# Altium schematic sheet CONNECTOR_BUFFER.SchDoc
size A4; DrawnBy: Copyright © 2023 by; Engineer: Artyom Kislevitz Lee; Revision: A
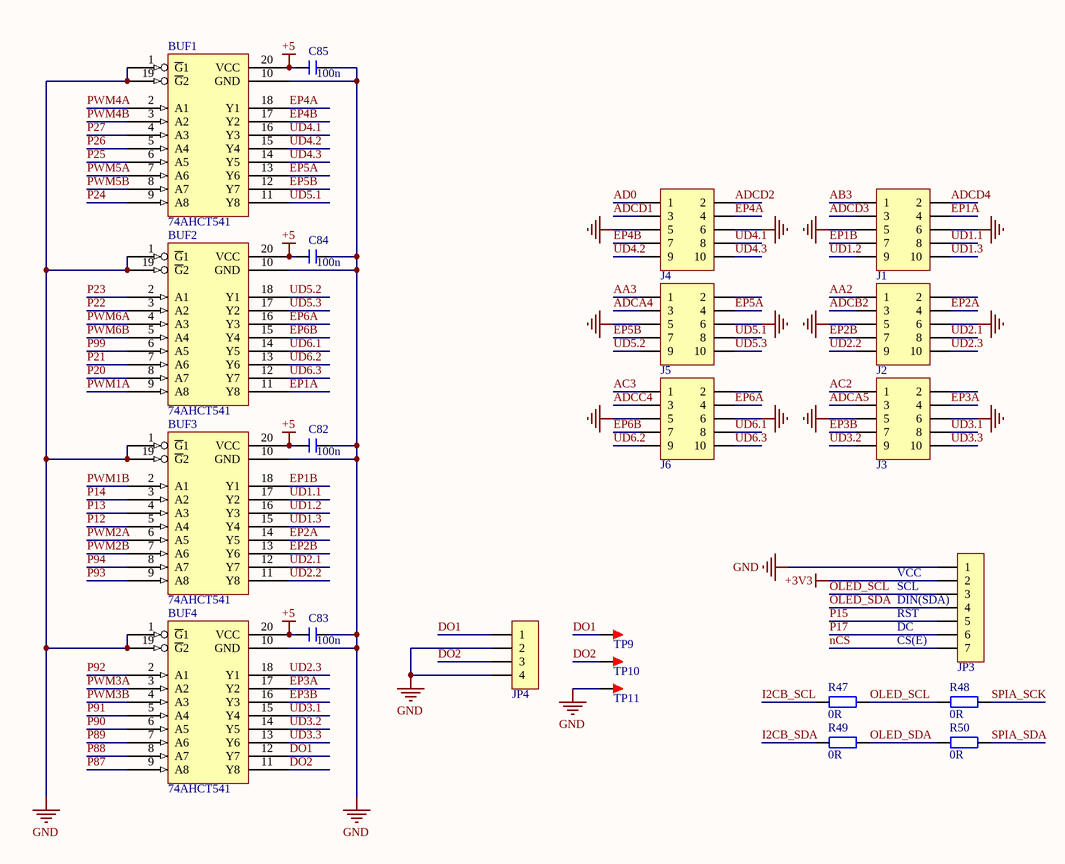
[diagram p0: CONNECTOR_BUFFER.SchDoc]

## Parts
BUF1  74AHCT541  [TSSOP20_N]
BUF2  74AHCT541  [TSSOP20_N]
BUF3  74AHCT541  [TSSOP20_N]
BUF4  74AHCT541  [TSSOP20_N]
C82  100n  [C 0805_L]
C83  100n  [C 0805_L]
C84  100n  [C 0805_L]
C85  100n  [C 0805_L]
J1  Header 5X2  [IDC2.54-LI-2x5P]  (value not drawn)
J2  Header 5X2  [IDC2.54-LI-2x5P]  (value not drawn)
J3  Header 5X2  [IDC2.54-LI-2x5P]  (value not drawn)
J4  Header 5X2  [IDC2.54-LI-2x5P]  (value not drawn)
J5  Header 5X2  [IDC2.54-LI-2x5P]  (value not drawn)
J6  Header 5X2  [IDC2.54-LI-2x5P]  (value not drawn)
JP3  HDR-1X7  [HDR2.54-M-LI-7P]  (value not drawn)
JP4  HDR-1X4  [HDR2.54-LI-4P]  (value not drawn)
R47  0R  [R 0805_L]
R48  0R  [R 0805_L]
R49  0R  [R 0805_L]
R50  0R  [R 0805_L]
TP9  TEST TP  [TEST TP1.4_B]  (value not drawn)
TP10  TEST TP  [TEST TP1.4_B]  (value not drawn)
TP11  TEST TP  [TEST TP1.4_B]  (value not drawn)

## Nets
+3V3: JP3.2
+5: BUF1.20(VCC) BUF2.20(VCC) BUF3.20(VCC) BUF4.20(VCC) C82.2 C83.2 C84.2 C85.2
GND: BUF1.1(~{G}1) BUF1.10(GND) BUF1.19(~{G}2) BUF2.1(~{G}1) BUF2.10(GND) BUF2.19(~{G}2) BUF3.1(~{G}1) BUF3.10(GND) BUF3.19(~{G}2) BUF4.1(~{G}1) BUF4.10(GND) BUF4.19(~{G}2) C82.1 C83.1 C84.1 C85.1 J1.5 J1.6 J2.5 J2.6 J3.5 J3.6 J4.5 J4.6 J5.5 J5.6 J6.5 J6.6 JP3.1 JP4.2 JP4.4 TP11.1
AA2: J2.1
AA3: J5.1
AB3: J1.1
AC2: J3.1
AC3: J6.1
AD0: J4.1
ADCA4: J5.3
ADCA5: J3.3
ADCB2: J2.3
ADCC4: J6.3
ADCD1: J4.3
ADCD2: J4.2
ADCD3: J1.3
ADCD4: J1.2
DO1: BUF4.12(Y7) JP4.1 TP9.1
DO2: BUF4.11(Y8) JP4.3 TP10.1
EP1A: BUF2.11(Y8) J1.4
EP1B: BUF3.18(Y1) J1.7
EP2A: BUF3.14(Y5) J2.4
EP2B: BUF3.13(Y6) J2.7
EP3A: BUF4.17(Y2) J3.4
EP3B: BUF4.16(Y3) J3.7
EP4A: BUF1.18(Y1) J4.4
EP4B: BUF1.17(Y2) J4.7
EP5A: BUF1.13(Y6) J5.4
EP5B: BUF1.12(Y7) J5.7
EP6A: BUF2.16(Y3) J6.4
EP6B: BUF2.15(Y4) J6.7
I2CB_SCL: R47.1
I2CB_SDA: R49.1
nCS: JP3.7
OLED_SCL: JP3.3 R47.2 R48.1
OLED_SDA: JP3.4 R49.2 R50.1
P12: BUF3.5(A4)
P13: BUF3.4(A3)
P14: BUF3.3(A2)
P15: JP3.5
P17: JP3.6
P20: BUF2.8(A7)
P21: BUF2.7(A6)
P22: BUF2.3(A2)
P23: BUF2.2(A1)
P24: BUF1.9(A8)
P25: BUF1.6(A5)
P26: BUF1.5(A4)
P27: BUF1.4(A3)
P87: BUF4.9(A8)
P88: BUF4.8(A7)
P89: BUF4.7(A6)
P90: BUF4.6(A5)
P91: BUF4.5(A4)
P92: BUF4.2(A1)
P93: BUF3.9(A8)
P94: BUF3.8(A7)
P99: BUF2.6(A5)
PWM1A: BUF2.9(A8)
PWM1B: BUF3.2(A1)
PWM2A: BUF3.6(A5)
PWM2B: BUF3.7(A6)
PWM3A: BUF4.3(A2)
PWM3B: BUF4.4(A3)
PWM4A: BUF1.2(A1)
PWM4B: BUF1.3(A2)
PWM5A: BUF1.7(A6)
PWM5B: BUF1.8(A7)
PWM6A: BUF2.4(A3)
PWM6B: BUF2.5(A4)
SPIA_SCK: R48.2
SPIA_SDA: R50.2
UD1.1: BUF3.17(Y2) J1.8
UD1.2: BUF3.16(Y3) J1.9
UD1.3: BUF3.15(Y4) J1.10
UD2.1: BUF3.12(Y7) J2.8
UD2.2: BUF3.11(Y8) J2.9
UD2.3: BUF4.18(Y1) J2.10
UD3.1: BUF4.15(Y4) J3.8
UD3.2: BUF4.14(Y5) J3.9
UD3.3: BUF4.13(Y6) J3.10
UD4.1: BUF1.16(Y3) J4.8
UD4.2: BUF1.15(Y4) J4.9
UD4.3: BUF1.14(Y5) J4.10
UD5.1: BUF1.11(Y8) J5.8
UD5.2: BUF2.18(Y1) J5.9
UD5.3: BUF2.17(Y2) J5.10
UD6.1: BUF2.14(Y5) J6.8
UD6.2: BUF2.13(Y6) J6.9
UD6.3: BUF2.12(Y7) J6.10

Not connected (* = marked no-connect by the designer): J2 2; J3 2; J5 2; J6 2

## Notes on the sheet
- (near JP3) VCC
- (near JP3) SCL
- (near JP3) DIN(SDA)
- (near JP3) RST
- (near JP3) CS(E)
- (near JP3) DC
- Project
- Title
- Size:
- Date:
- A4
- Number:
- Time:
- Revision:
- Sheet
- of
- Copyright © 2023 by
- Artyom Kislevitz Lee
- File:

## Library data of the parts
C82-C85 = C: 贴片电容; 淘宝ID: 小糖豆的小窝窝; BOM名称: 贴片电容; 下单链接: https://item.taobao.com/item.htm?ft=t&id=613637044352
J1-J6 = Header 5X2: 5*2P接插件; 淘宝ID: 小糖豆的小窝窝; BOM名称: 5*2P接插件; 下单链接: https://item.taobao.com/item.htm?ft=t&id=613637044352
JP3 = Header 7: 7P接插件; 淘宝ID: 小糖豆的小窝窝; BOM名称: 7P接插件; 下单链接: https://item.taobao.com/item.htm?ft=t&id=613637044352
JP4 = Header 4: 4P接插件; 淘宝ID: 小糖豆的小窝窝; BOM名称: 4P接插件; 下单链接: https://item.taobao.com/item.htm?ft=t&id=613637044352
R47-R50 = R: 贴片电阻; 淘宝ID: 小糖豆的小窝窝; BOM名称: 贴片电阻; 下单链接: https://item.taobao.com/item.htm?ft=t&id=613637044352
TP9-TP11 = TEST TP: 测试环; 淘宝ID: 小糖豆的小窝窝; BOM名称: 测试环; 下单链接: https://item.taobao.com/item.htm?ft=t&id=613637044352